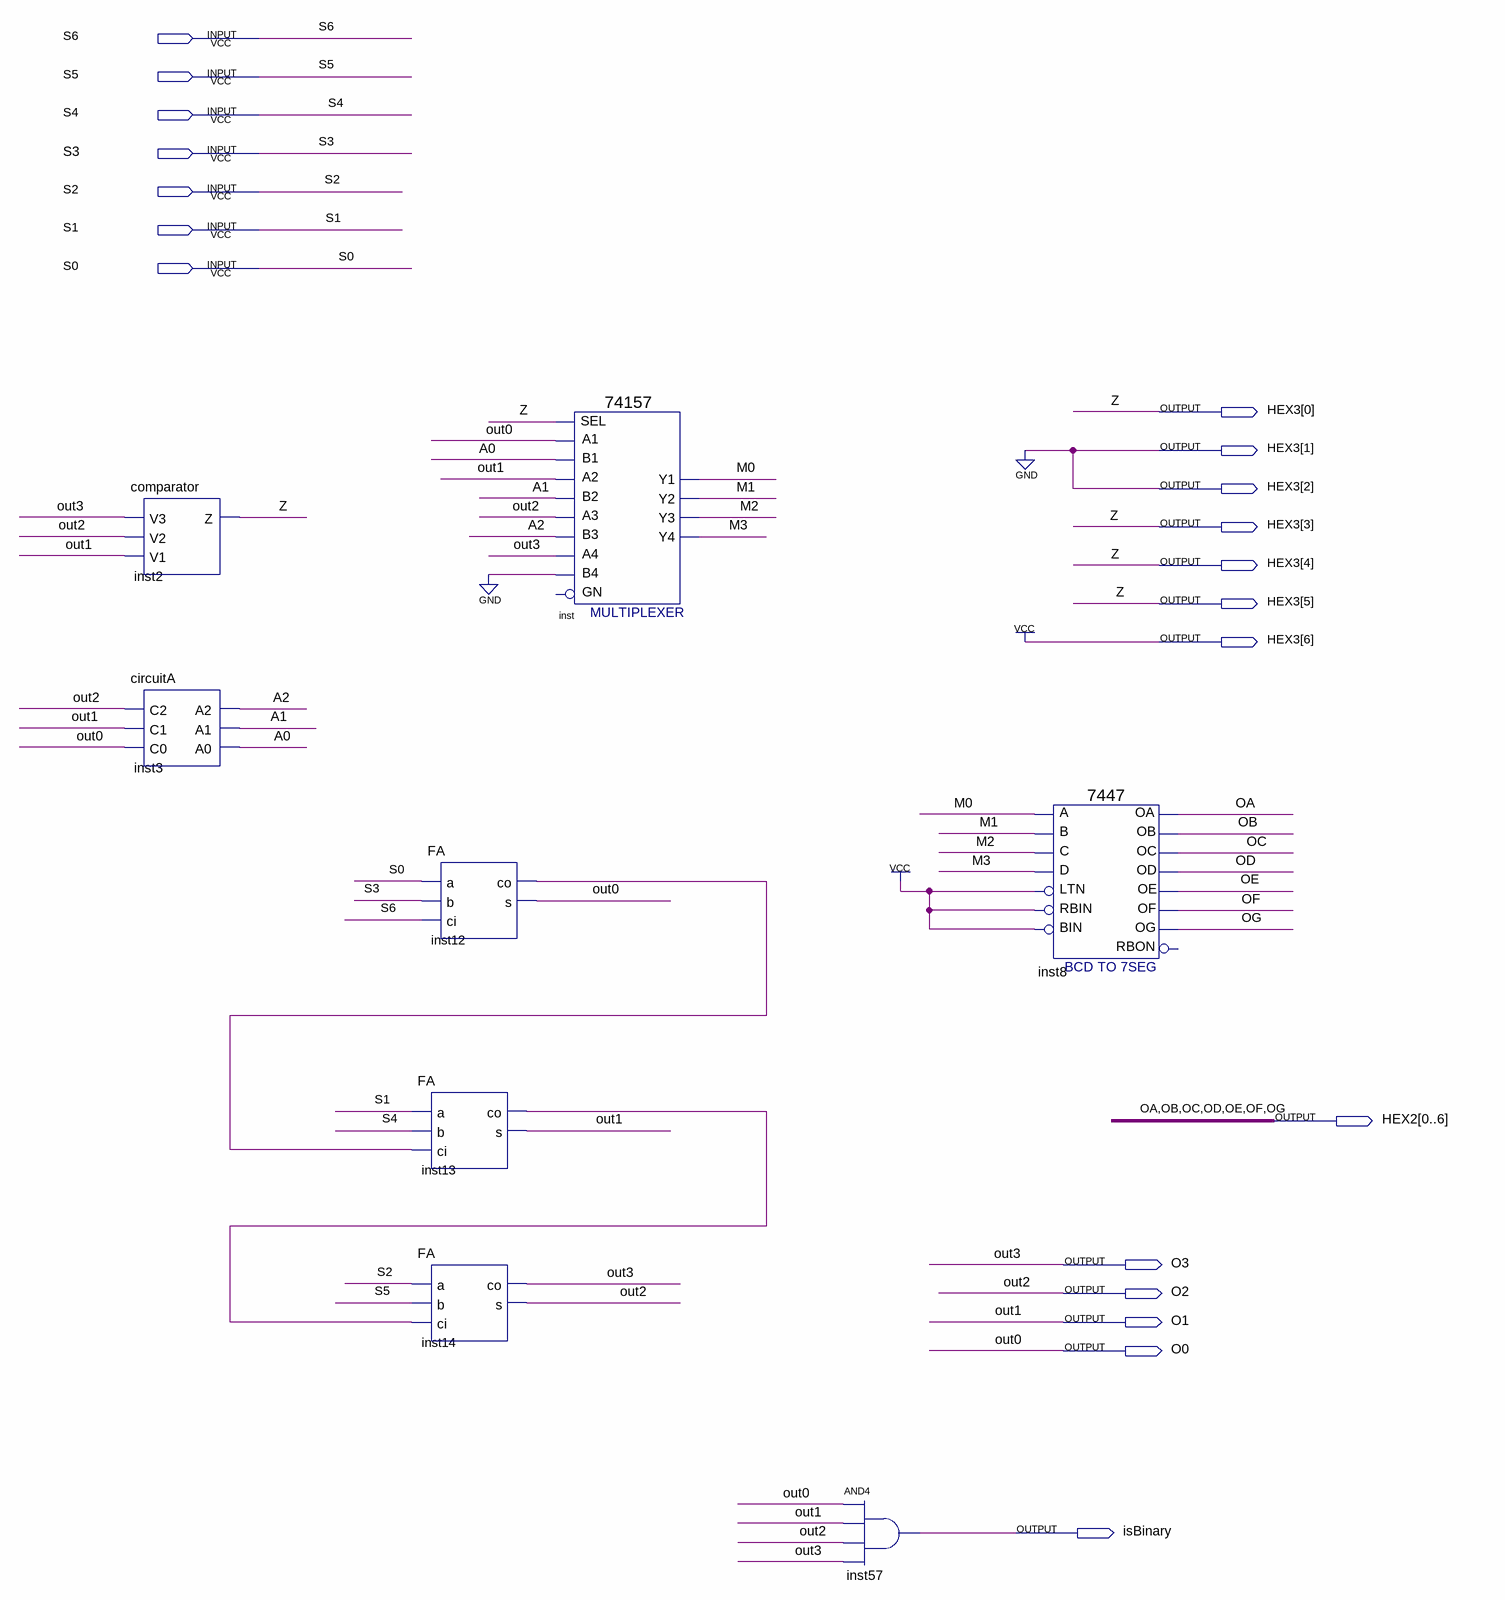
[diagram p0: schematic sheet]
// Quartus schematic lab3c.bdf as structural Verilog: 8 symbols, 20 pins
module lab3c (
  input  S6,
  input  S5,
  input  S4,
  input  S3,
  input  S2,
  input  S1,
  input  S0,
  output [6:0] HEX3,
  output [0:6] HEX2,
  output O3,
  output O2,
  output O1,
  output O0,
  output isBinary
);

  wire A0, A1, A2, inst12_co, inst13_co, M0, M1, M2, M3;

  comparator inst2 (.V3(O3), .V2(O2), .V1(O1), .Z(HEX3[5]));
  circuitA inst3 (.C2(O2), .C1(O1), .C0(O0), .A2(A2), .A1(A1), .A0(A0));
  FA inst12 (.a(S0), .b(S3), .ci(S6), .co(inst12_co), .s(O0));
  FA inst13 (.a(S1), .b(S4), .ci(inst12_co), .co(inst13_co), .s(O1));
  FA inst14 (.a(S2), .b(S5), .ci(inst13_co), .co(O3), .s(O2));
  \74157  inst (
    .A1(O0), .B1(A0), .SEL(HEX3[5]), .B2(A1), .A3(O2), .B3(A2), .A2(O1), .B4(1'b0), .A4(O3), .Y2(M1),
    .Y1(M0), .Y4(M3), .Y3(M2));  // open: GN
  and inst57 (isBinary, O0, O1, O2, O3);
  \7447  inst8 (
    .LTN(1'b1), .B(M1), .C(M2), .D(M3), .RBIN(1'b1), .BIN(1'b1), .A(M0), .OB(HEX2[1]), .OC(HEX2[2]),
    .OE(HEX2[4]), .OD(HEX2[3]), .OF(HEX2[5]), .OG(HEX2[6]), .OA(HEX2[0]));  // open: RBON

  assign {HEX3[6], HEX3[4:0]} = {1'b1, {2{HEX3[5]}}, 2'b00, HEX3[5]};

  // Other names for the same wires on the sheet: OA = HEX2[0]; OB = HEX2[1]; OC = HEX2[2]; OD = HEX2[3]; OE = HEX2[4];
  //   OF = HEX2[5]; OG = HEX2[6]; out0 = O0; out1 = O1; out2 = O2; out3 = O3; Z = HEX3[5]
endmodule
